# EasyEDA schematic SCH_CJ4-PFD-Menu-Panel.json
TITLE: CJ4 PFD Menu panel; REV: 1.0; Date: 2021-06-11; Sheet: 1/1; Drawn By: Tuomas Kuosmanen; Company: Your Company
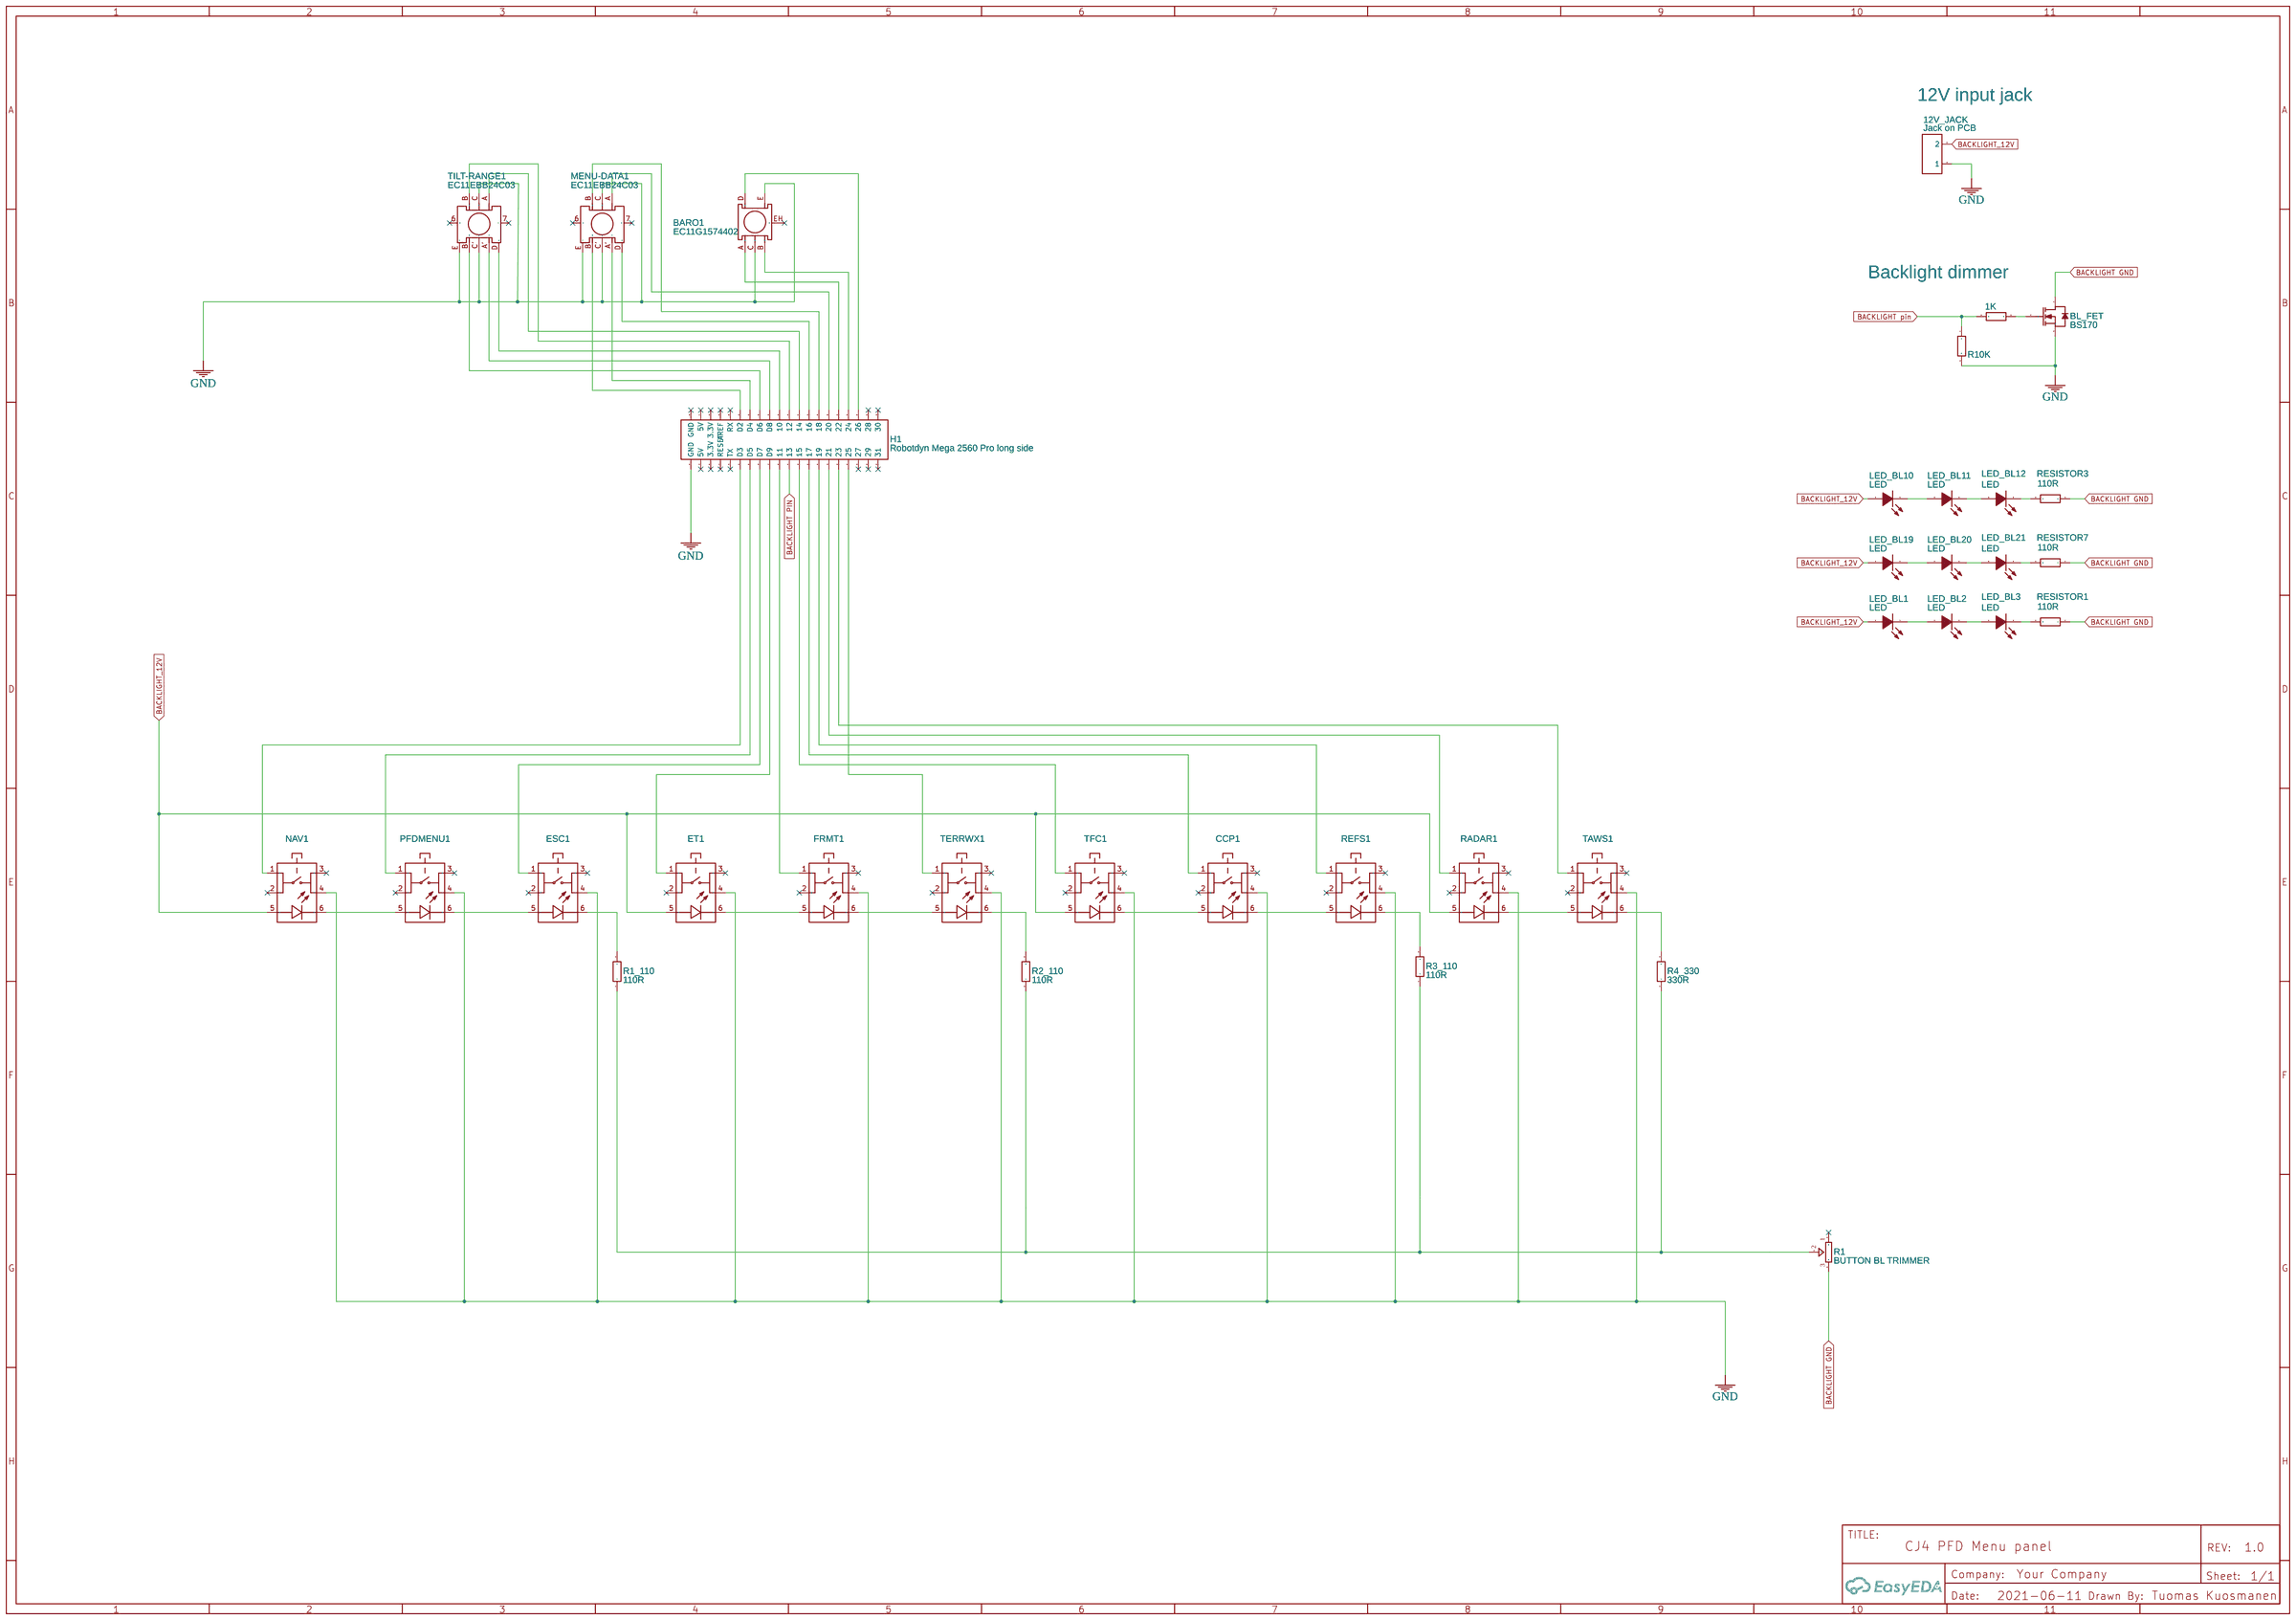
[diagram p0: schematic sheet]

## Parts
12V_JACK  Jack on PCB  [JACK ON PCB]
BARO1  EC11G1574402  [SW-TH_EC11M1565403]
BL_FET  BS170  [TO-92-3_L4.9-W3.7-P1.27-L]
CCP1  MULTIMEC 3FTH980 - Key Switch, 50 mA, 24 VDC, MEC  [MULTIMEC 3FTH980 - KEY SWITCH, 50 MA, 24 VDC, MEC]
ESC1  MULTIMEC 3FTH980 - Key Switch, 50 mA, 24 VDC, MEC  [MULTIMEC 3FTH980 - KEY SWITCH, 50 MA, 24 VDC, MEC]
ET1  MULTIMEC 3FTH980 - Key Switch, 50 mA, 24 VDC, MEC  [MULTIMEC 3FTH980 - KEY SWITCH, 50 MA, 24 VDC, MEC]
FRMT1  MULTIMEC 3FTH980 - Key Switch, 50 mA, 24 VDC, MEC  [MULTIMEC 3FTH980 - KEY SWITCH, 50 MA, 24 VDC, MEC]
H1  Robotdyn Mega 2560 Pro long side  [HDR-TH_40P-P2.54-V-M-R2-C20-S2.54]
LED_BL1  LED  [LED1206-RD]
LED_BL2  LED  [LED1206-RD]
LED_BL3  LED  [LED1206-RD]
LED_BL10  LED  [LED1206-RD]
LED_BL11  LED  [LED1206-RD]
LED_BL12  LED  [LED1206-RD]
LED_BL19  LED  [LED1206-RD]
LED_BL20  LED  [LED1206-RD]
LED_BL21  LED  [LED1206-RD]
MENU-DATA1  EC11EBB24C03  [SW-TH_EC11EBB24C03]
NAV1  MULTIMEC 3FTH980 - Key Switch, 50 mA, 24 VDC, MEC  [MULTIMEC 3FTH980 - KEY SWITCH, 50 MA, 24 VDC, MEC]
PFDMENU1  MULTIMEC 3FTH980 - Key Switch, 50 mA, 24 VDC, MEC  [MULTIMEC 3FTH980 - KEY SWITCH, 50 MA, 24 VDC, MEC]
PROTECT_BL1  1K  [R1206]
R1  BUTTON BL TRIMMER  [TRIMMER_3362P]
R1_110  110R  [R1206]
R2_110  110R  [R1206]
R3_110  110R  [R1206]
R4_330  330R  [R1206]
R_ANN5  R10K  [R1206]
RADAR1  MULTIMEC 3FTH980 - Key Switch, 50 mA, 24 VDC, MEC  [MULTIMEC 3FTH980 - KEY SWITCH, 50 MA, 24 VDC, MEC]
REFS1  MULTIMEC 3FTH980 - Key Switch, 50 mA, 24 VDC, MEC  [MULTIMEC 3FTH980 - KEY SWITCH, 50 MA, 24 VDC, MEC]
RESISTOR1  110R  [R1206]
RESISTOR3  110R  [R1206]
RESISTOR7  110R  [R1206]
TAWS1  MULTIMEC 3FTH980 - Key Switch, 50 mA, 24 VDC, MEC  [MULTIMEC 3FTH980 - KEY SWITCH, 50 MA, 24 VDC, MEC]
TERRWX1  MULTIMEC 3FTH980 - Key Switch, 50 mA, 24 VDC, MEC  [MULTIMEC 3FTH980 - KEY SWITCH, 50 MA, 24 VDC, MEC]
TFC1  MULTIMEC 3FTH980 - Key Switch, 50 mA, 24 VDC, MEC  [MULTIMEC 3FTH980 - KEY SWITCH, 50 MA, 24 VDC, MEC]
TILT-RANGE1  EC11EBB24C03  [SW-TH_EC11EBB24C03]

## Library data of the parts
12V_JACK = J-Header-Male-2.54_1x2: Manufacturer: TE Connectivity; image: //image.lceda.cn/szlcsc/C86471.jpg; link: //image.lceda.cn/szlcsc/C86471.jpg; Package Display: No
BARO1 = EC11G1574402: Supplier: LCSC; Supplier Part: C470760; Manufacturer: ALPS Electric; Contributor: LCSC; LCSC Assembly: Yes; SMT Type: Extend; Paste Type: expand
BL_FET = BS170: Supplier: LCSC; Manufacturer: FAIRCHILD; Supplier Part: C111691; JLCPCB Part Class: Extended Part
CCP1 ESC1 ET1 FRMT1 NAV1 PFDMENU1 RADAR1 REFS1 TAWS1 TERRWX1 TFC1 = MULTIMEC 3FTH980 - Key Switch, 50 mA, 24 VDC, MEC: Manufacturer Part: 1052612; link: https://www.elfadistrelec.no/Web/Downloads/he/et/3A3F4F_eng_datasheet.pdf; Contributor: smund3
H1 = Header-Male-2.54_2x20: Supplier: LCSC; Manufacturer: ReliaPro; Supplier Part: C50980; JLCPCB Part Class: Extended Part
LED_BL1-LED_BL3 LED_BL10-LED_BL12 LED_BL19-LED_BL21 = HQ17-2102UYOC: Supplier: LCSC; Manufacturer: HARVATEK; Contributor: LCSC; Supplier Part: C154481; JLCPCB Part Class: Extended Part
MENU-DATA1 TILT-RANGE1 = EC11EBB24C03: Supplier: LCSC; Supplier Part: C470790; Manufacturer: ALPS Electric; Contributor: LCSC
PROTECT_BL1 R1_110 R2_110 R3_110 R4_330 R_ANN5 RESISTOR1 RESISTOR3 RESISTOR7 = 1206W4J0331T5E: Supplier: LCSC; Manufacturer: UniOhm; Supplier Part: C25374
R1 = TRIMMER: Contributor: DangerousPrototype

## Nets
GND: 12V_JACK.1 BARO1.C BARO1.E BL_FET.3(S) CCP1.4 ESC1.4 ET1.4 FRMT1.4 H1.1(GND) MENU-DATA1.C MENU-DATA1.C' MENU-DATA1.E NAV1.4 PFDMENU1.4 R_ANN5.2 RADAR1.4 REFS1.4 TAWS1.4 TERRWX1.4 TFC1.4 TILT-RANGE1.C TILT-RANGE1.C' TILT-RANGE1.E
BACKLIGHT GND: BL_FET.1(D) R1.3 RESISTOR1.1 RESISTOR3.1 RESISTOR7.1
BACKLIGHT PIN: H1.21(13)
BACKLIGHT pin: PROTECT_BL1.2 R_ANN5.1
BACKLIGHT_12V: 12V_JACK.2 ET1.5(2) LED_BL1.2(A) LED_BL10.2(A) LED_BL19.2(A) NAV1.5(2) RADAR1.5(2) TFC1.5(2)
Net-(BARO1-A): BARO1.A H1.32(22)
Net-(BARO1-B): BARO1.B H1.34(24)
Net-(BARO1-D): BARO1.D H1.36(26)
Net-(BL_FET-2): BL_FET.2(G) PROTECT_BL1.1
Net-(CCP1-1): CCP1.1 H1.25(17)
Net-(CCP1-5): CCP1.5(2) TFC1.6(4)
Net-(CCP1-6): CCP1.6(4) REFS1.5(2)
Net-(ESC1-1): ESC1.1 H1.15(D7)
Net-(ESC1-5): ESC1.5(2) PFDMENU1.6(4)
Net-(ESC1-6): ESC1.6(4) R1_110.2
Net-(ET1-1): ET1.1 H1.17(D9)
Net-(ET1-6): ET1.6(4) FRMT1.5(2)
Net-(FRMT1-1): FRMT1.1 H1.19(11)
Net-(FRMT1-6): FRMT1.6(4) TERRWX1.5(2)
Net-(H1-11): H1.11(D3) NAV1.1
Net-(H1-12): H1.12(D2) MENU-DATA1.B'
Net-(H1-13): H1.13(D5) PFDMENU1.1
Net-(H1-14): H1.14(D4) MENU-DATA1.A'
Net-(H1-16): H1.16(D6) TILT-RANGE1.B'
Net-(H1-18): H1.18(D8) TILT-RANGE1.A'
Net-(H1-20): H1.20(10) TILT-RANGE1.D
Net-(H1-22): H1.22(12) TILT-RANGE1.B
Net-(H1-23): H1.23(15) TFC1.1
Net-(H1-24): H1.24(14) TILT-RANGE1.A
Net-(H1-26): H1.26(16) MENU-DATA1.D
Net-(H1-27): H1.27(19) REFS1.1
Net-(H1-28): H1.28(18) MENU-DATA1.B
Net-(H1-29): H1.29(21) RADAR1.1
Net-(H1-30): H1.30(20) MENU-DATA1.A
Net-(H1-31): H1.31(23) TAWS1.1
Net-(H1-33): H1.33(25) TERRWX1.1
Net-(LED_BL1-1): LED_BL1.1(K) LED_BL2.2(A)
Net-(LED_BL2-1): LED_BL2.1(K) LED_BL3.2(A)
Net-(LED_BL3-1): LED_BL3.1(K) RESISTOR1.2
Net-(LED_BL10-1): LED_BL10.1(K) LED_BL11.2(A)
Net-(LED_BL11-1): LED_BL11.1(K) LED_BL12.2(A)
Net-(LED_BL12-1): LED_BL12.1(K) RESISTOR3.2
Net-(LED_BL19-1): LED_BL19.1(K) LED_BL20.2(A)
Net-(LED_BL20-1): LED_BL20.1(K) LED_BL21.2(A)
Net-(LED_BL21-1): LED_BL21.1(K) RESISTOR7.2
Net-(NAV1-6): NAV1.6(4) PFDMENU1.5(2)
Net-(R1-2): R1.2 R1_110.1 R2_110.1 R3_110.1 R4_330.1
Net-(R2_110-2): R2_110.2 TERRWX1.6(4)
Net-(R3_110-2): R3_110.2 REFS1.6(4)
Net-(R4_330-2): R4_330.2 TAWS1.6(4)
Net-(RADAR1-6): RADAR1.6(4) TAWS1.5(2)

Not connected (* = marked no-connect by the designer): BARO1 EH*; CCP1 2* 3*; ESC1 2* 3*; ET1 2* 3*; FRMT1 2* 3*; H1 2(GND)* 3(5V)* 4(5V)* 5(3.3V)* 6(3.3V)* 7(RESET)* 8(AREF)* 9(TX)* 10(RX)* 35(27)* 37(29)* 38(28)* 39(31)* 40(30)*; MENU-DATA1 6* 7*; NAV1 2* 3*; PFDMENU1 2* 3*; R1 1*; RADAR1 2* 3*; REFS1 2* 3*; TAWS1 2* 3*; TERRWX1 2* 3*; TFC1 2* 3*; TILT-RANGE1 6* 7*

## Notes on the sheet
- 12V input jack
- Backlight dimmer
